# Altium schematic sheet Sheet1.SchDoc
size A4
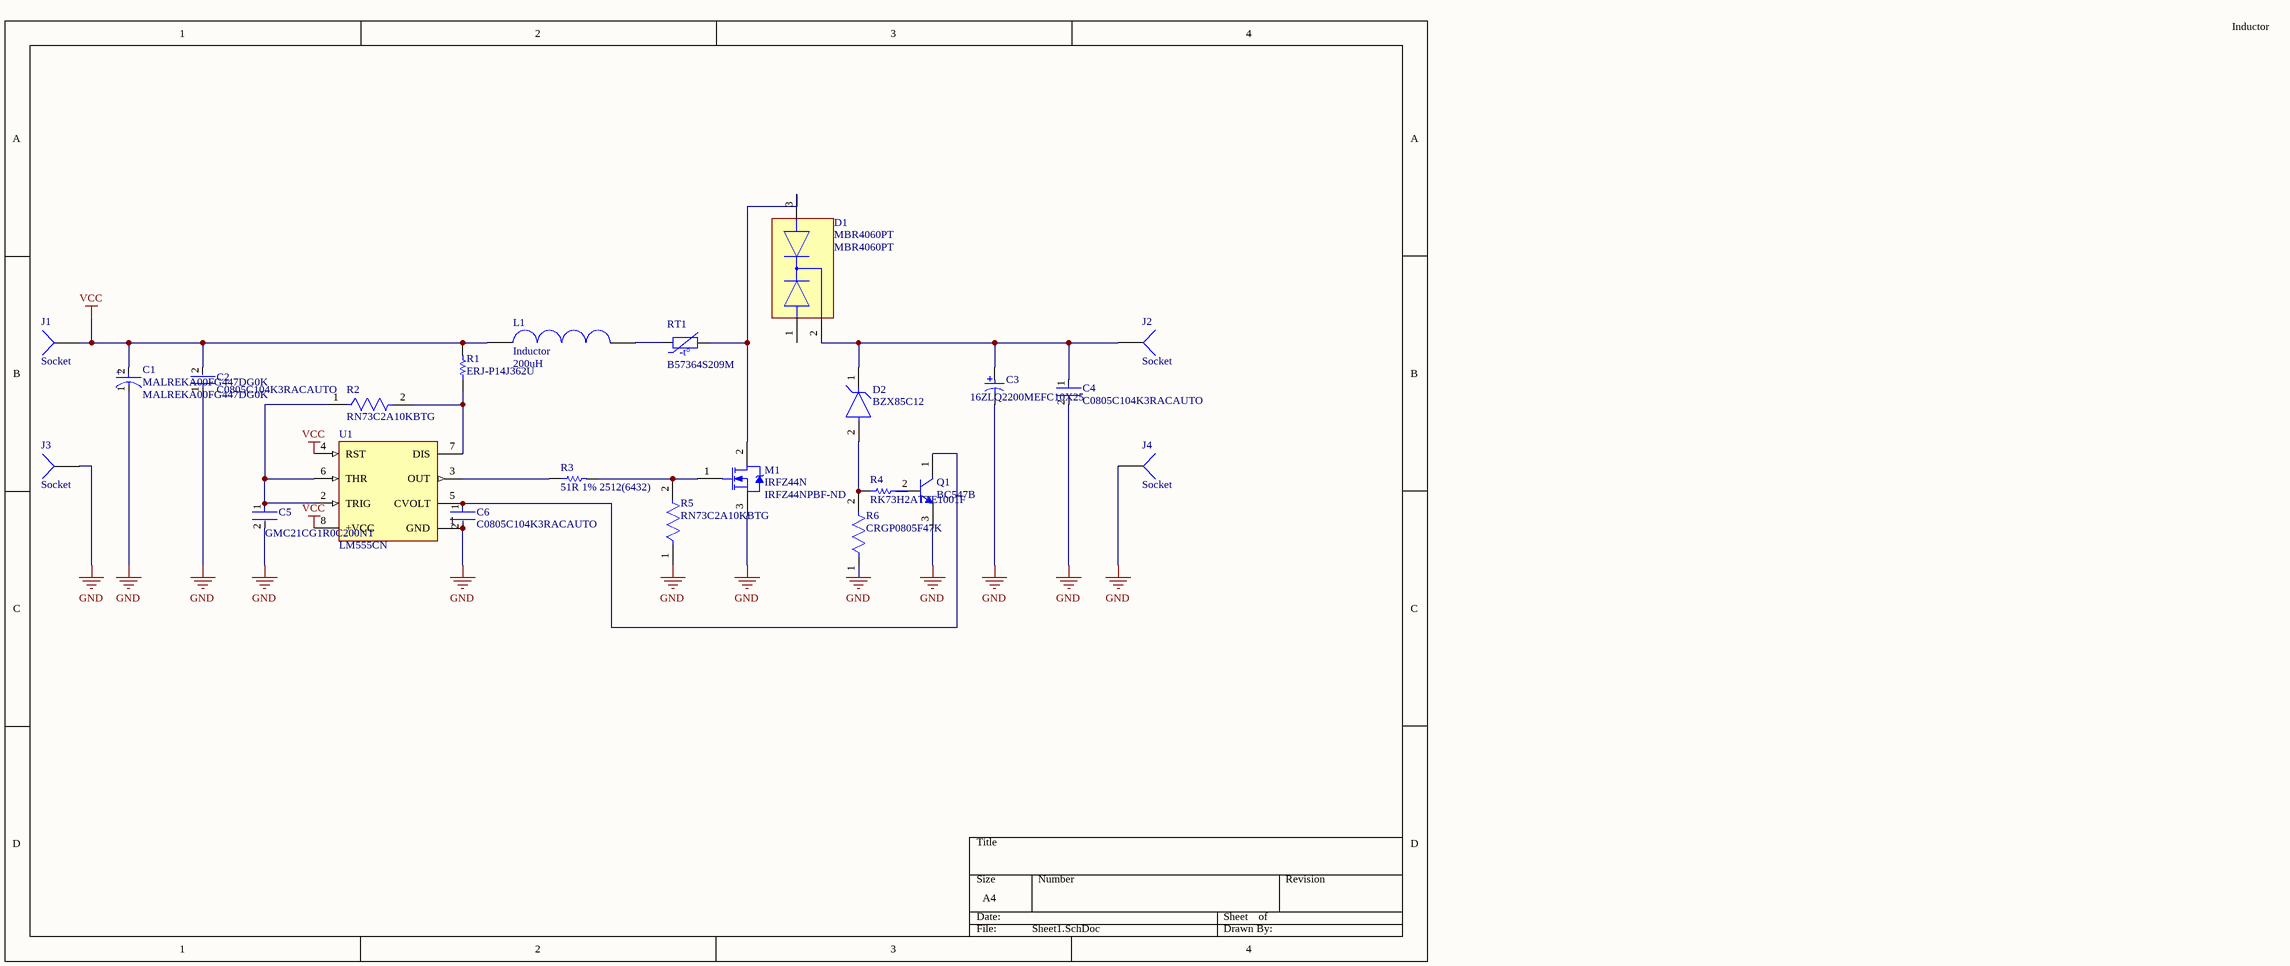
[diagram p0: Sheet1.SchDoc]

## Parts
C1  MALREKA00FG447DG0K  [FP-ECA-1HM102-MFG]
C2  C0805C104K3RACAUTO  [FP-C0805C-DN-IPC_A]
C3  16ZLQ2200MEFC10X25  [PNSC-EEUFM1H221-2]
C4  C0805C104K3RACAUTO  [FP-C0805C-DN-IPC_A]
C5  GMC21CG1R0C200NT  [FP-C0805C-DN-IPC_A]
C6  C0805C104K3RACAUTO  [FP-C0805C-DN-IPC_A]
D1  MBR4060PT  [FP-340BZ-MFG]
D2  BZX85C12  [FP-017AH-MFG]
J1  Socket  [PIN1]
J2  Socket  [PIN1]
J3  Socket  [PIN1]
J4  Socket  [PIN1]
L1  Inductor  value 200uH  [Inductor]
M1  IRFZ44N  Supplier Part Number 1: IRFZ44NPBF-ND  [INF-PG-TO220-3-1]
Q1  BC547B  [ONSC-TO-92-3-29-11]
R1  ERJ-P14J362U  [RESC3225X70X50ML20T20]
R2  RN73C2A10KBTG  [FP-RN732A-IPC_A]
R3  51R 1% 2512(6432)  [RESC2512(6432)_M]
R4  RK73H2ATTE1001F  [RESC2013X60X30ML20T20]
R5  RN73C2A10KBTG  [FP-RN732A-IPC_A]
R6  CRGP0805F47K  [FP-CRGP0805-IPC_A]
RT1  B57364S209M  [TDK-B57364]
U1  LM555CN  [N08E]

## Nets
GND: C1.1(C) C2.1 C3.2 C4.2 C5.2 C6.2 J3.1 J4.1 M1.3(SOURCE) Q1.3(E) R5.1 R6.1 U1.1(GND)
VCC: C1.2(A) C2.2 J1.1 L1.2 R1.2 U1.4(RST) U1.8(+VCC)
NetC3_1: C3.1 C4.1 D1.2(COMMON_CATHODE) D2.1(C) J2.1
NetC5_1: C5.1 R2.1 U1.2(TRIG) U1.6(THR)
NetC6_1: C6.1 Q1.1(C) U1.5(CVOLT)
NetD1_3: D1.3(2_ANODE) M1.2(DRAIN) RT1.1
NetD2_2: D2.2(A) R4.1 R6.2
NetL1_1: L1.1 RT1.2
NetM1_1: M1.1(GATE) R3.2 R5.2
NetQ1_2: Q1.2(B) R4.2
NetR1_1: R1.1 R2.2 U1.7(DIS)
NetR3_1: R3.1 U1.3(OUT)

Not connected (* = marked no-connect by the designer): D1 1(1_ANODE)

## Notes on the sheet
- Inductor
- (in symbol CMP-2000-05907-1) -t°
- (in symbol MALREKA00FG447DG0K) +

## Library data of the parts
C1 = MALREKA00FG447DG0K: Cap Alum 4700UF 20% 16V Radial; Manufacturer: Vishay Roederstein; Capacitance: 4.7mF; ESR (Equivalent Series Resistance): 80mR; Polarity: Polar; Ripple Current: 2.129A; Life (Hours): 2000Hour; Supplier 1: Avnet; Manufacturer Part Number: MALREKA00FG447DG0K; RoHS: Yes; Category: Aluminum Electrolytic Capacitors; Pricing 1: 2000=0,67103, 2800=0,65462, 4800=0,64540, 10000=0,62696, 20000=0,61313, 100000=0,59930, 200000=0,58547 (USD); Mount: Through Hole; Case/Package: Radial; Min Operating Temperature: -40°C; Max Operating Temperature: 85°C; Package Quantity: 400; Packaging: Bulk; Voltage Rating: 16V; Tolerance: 20%; Lead Pitch: 0.197inch; Height - Seated (Max): 1.063inch; RoHS Compliant: Yes; ComponentLink1URL: http://www.vishay.com/docs/25001/alucapsintroduction.pdf?src-supplier=Digi-Key; ComponentLink1Description: http://www.vishay.com/docs/25001/alucapsintroduction.pdf?src-supplier=Digi-Key; Supplier Part Number 1: MALREKA00FG447DG0K
C2 C4 C6 = CMP-2007-01164-2: CAP CER 0.1UF 25V X7R 0805; Manufacturer: KEMET; Temperature Coefficient: 30ppm/°C; Material: Ceramic; Capacitance: 0.10 μF; Value: 0.10 μF; Tolerance: 0.1; Ipc Land Pattern Name: CAPC200125X78; Height: 0.88mm; Device Class L3: Ceramic Capacitors; Temperature Characteristic: X7R; Temperature Range High: +125°C; Automotive: No; Category: Cap; Temperature Range Low: -55°C; Lead Free: Yes; Device Class L1: Passive Components; ComponentLink2Description: Datasheet; Manufacturer Part Number: C0805C104K3RACAUTO; Octopart: https://octopart.com/c0805c104k3racauto-kemet-12542886; Temperature: -55°C to +125°C; RoHS: TRUE; Package: C0805C-DN; Voltage Rating: 25 V; Device Class L2: Capacitors; Digikey Description: CAP CER 0.1UF 25V X7R 0805; Mouser Description: Smd Multilayer Ceramic Capacitor, Aec-Q200 C Series, 0.1 F, 10%, X7r, 25 V, 0805 [2012 Metric]; ComponentLink2URL: https://content.kemet.com/datasheets/KEM_C1003_C0G_SMD.pdf
C3 = 16ZLQ2200MEFC10X25: Cap Aluminum Lytic 2200uF 16V 20% (10 X 25mm) Radial 5mm 2500mA 5000h 105C; Manufacturer: Rubycon; Life (Hours): 5000Hour; Capacitance: 2.2mF; Polarity: Polar; Ripple Current: 1.75A; Impedance: 15mR; Supplier 1: Digi-Key; Manufacturer Part Number: 16ZLQ2200MEFC10X25; RoHS: Yes; Category: Aluminum Electrolytic Capacitors; Stock 1: 488; Pricing 1: 1=0,98000, 10=0,72100, 50=0,57700, 100=0,49460, 500=0,39156, 1000=0,32973, 2500=0,30912, 5000=0,28851 (USD); Mount: Through Hole; Case/Package: Radial; Min Operating Temperature: -40°C; Max Operating Temperature: 105°C; Tolerance: 20%; Packaging: Bulk; Voltage Rating: 16V; Lead Pitch: 0.197inch; Height - Seated (Max): 1.063inch; ComponentLink1URL: http://www.rubycon.co.jp/en/catalog/e_pdfs/aluminum/e_ZLQ.pdf?src-supplier=Digi-Key; ComponentLink1Description: http://www.rubycon.co.jp/en/catalog/e_pdfs/aluminum/e_ZLQ.pdf?src-supplier=Digi-Key
C5 = CMP-2007-00243-2: / 1 pF ±0.25pF 200V Ceramic Capacitor C0G, NP0 0805R 0805; Manufacturer: KEMET; Manufacturer Part Number: C0805C102K5RACAUTO; Temperature Coefficient: 30ppm/°C; Capacitance: 1pF; Temperature Characteristic: X7R; Value: 1 pF; Tolerance: 0.1; Temperature: -55°C to +125°C; Digikey Description: 1 pF ±0.25pF 200V Ceramic Capacitor C0G, NP0 0805 (2012 Metric); Temperature Range Low: -55°C; Package: C0805C-DN; Ipc Land Pattern Name: CAPC200125X78; ComponentLink2Description: Datasheet; Device Class L3: Ceramic Capacitors; Temperature Range High: +125°C; Category: Cap; Octopart: https://octopart.com/c0805c102k5racauto-kemet-12563740; RoHS: TRUE; ComponentLink2URL: https://content.kemet.com/datasheets/KEM_C1003_C0G_SMD.pdf; Device Class L2: Capacitors; Automotive: No; Mouser Description: Cap Ceramic 0.001uF 50V X7R 10% Pad SMD 0805 125C Automotive T/R; Height: 0.88mm; Device Class L1: Passive Components; Lead Free: Yes; Material: Ceramic; Voltage Rating: 200 V
D1 = MBR4060PT: Schottky Diodes & Rectifiers 43 amp Rectifiers Schottky Barrier; Manufacturer: ON Semiconductor / Fairchild; Element Configuration: Common Cathode; Max Repetitive Reverse Voltage (Vrrm): 60V; Forward Current: 40A; Max Reverse Current: 100mA; Peak Non-Repetitive Surge Current: 400A; Forward Voltage: 720mV; Max Reverse Leakage Current: 1mA; Supplier 1: Arrow Electronics; Manufacturer Part Number: MBR4060PT; RoHS: Yes; Category: Schottky Diodes; Stock 1: 226; Pricing 1: 1=2,70350, 10=1,95840, 100=1,82790, 250=1,49630, 500=1,48140, 1000=1,41390 (USD); Mount: Through Hole; Case/Package: TO-247; Number of Pins: 3; Weight: 5.508g; Min Operating Temperature: -65°C; Max Operating Temperature: 150°C; Packaging: Rail/Tube; Package Quantity: 30; Average Rectified Current: 40A; Max Reverse Voltage (DC): 60V; Max Forward Surge Current (Ifsm): 400A; Max Surge Current: 400A; Current Rating: 40A; Voltage Rating (DC): 60V; Length: 16.4mm; Width: 5.22mm; Height: 21.3mm; Radiation Hardening: No; RoHS Compliant: Yes; Lead Free: Lead Free; ComponentLink1URL: https://datasheet.ciiva.com/4714/mbr4060pt-195686-4714526.pdf?src-supplier=Mouser; ComponentLink1Description: https://datasheet.ciiva.com/4714/mbr4060pt-195686-4714526.pdf?src-supplier=Mouser; ComponentLink2URL: https://datasheet.ciiva.com/17322/mbr4060pt-17322588.pdf?src-supplier=Future+Electronics; ComponentLink2Description: https://datasheet.ciiva.com/17322/mbr4060pt-17322588.pdf?src-supplier=Future+Electronics; ComponentLink3URL: https://datasheet.ciiva.com/8300/mbr4060pt-8300748.pdf?src-supplier=Avnet; ComponentLink3Description: https://datasheet.ciiva.com/8300/mbr4060pt-8300748.pdf?src-supplier=Avnet; Supplier Part Number 1: MBR4060PT
D2 = CMP-07164-000008-1: DIODE ZENER 12V 1W DO41; Manufacturer: ON Semiconductor; Max Zener Voltage: 12.7V; Zener Impedance: 9Ω; Reverse Voltage: 8.4V; Forward Current: 200mA; Max Reverse Leakage Current: 0.5uA; Max Junction Temp: +200°C; Device Class L3: Zener Diodes; Device Class L2: Diodes; ComponentLink2URL: https://www.onsemi.com/pub/Collateral/BZX85C3V3-D.PDF; Mouser Description: Zener Diodes 12V 1W Zener; Automotive: No; Ipc Land Pattern Name: DIOPA1088W105L520D272; Digikey Description: DIODE ZENER 12V 1W DO41; Power Dissipation: 1W; Temperature Range High: +200°C; Height: 2.72mm; Package: 017AH; RoHS: TRUE; Category: Diode; Lead Free: Yes; Octopart: https://octopart.com/bzx85c12-on+semiconductor-84409056; Device Class L1: Discrete Semiconductors; Nom Zener Voltage: 12V; Manufacturer Part Number: BZX85C12; Temperature Range Low: -65°C; Footprint Url: https://www.onsemi.com/pub/Collateral/017AH.PDF; Temperature: -65°C to +200°C; ComponentLink2Description: Datasheet
M1 = IRFZ44N: MOSFET, Power; N-Ch; VDSS 55V; RDS(ON) 17.5 Milliohms; ID 49A; TO-220AB; PD 94W; -55deg; Manufacturer: International Rectifier; Rise Time: 185ns; Gate to Source Voltage (Vgs): 20V; Turn-On Delay Time: 19ns; Turn-Off Delay Time: 85ns; Fall Time: 165ns; Number of Elements: 1; Supplier 1: Digi-Key; Manufacturer Part Number: IRFZ44N; RoHS: No; Category: MOSFETs; Stock 1: 16256; Pricing 1: 1=1,25000, 10=1,12000, 25=1,06280, 100=0,87290, 500=0,72108, 1000=0,57752 (USD); Mount: Through Hole; Case/Package: TO-220AB; Number of Pins: 3; Min Operating Temperature: -55°C; Max Operating Temperature: 175°C; Continuous Drain Current (ID): 49A; Power Dissipation: 94W; ComponentLink1URL: http://components.arrow.com/part/dataview/0323_01885316?src-supplier=Arrow+Europe; ComponentLink1Description: http://components.arrow.com/part/dataview/0323_01885316?src-supplier=Arrow+Europe
Q1 = CMP-1048-01467-1: Amplifier Transistor, NPN Silicon, 3-Pin TO-92, Bulk Box; Manufacturer: On Semiconductor; IC Continuous (A): 0.1; fT Min (MHz): 150; DatasheetVersion: Rev. 7; ComponentLink1URL: http://www.onsemi.com/; Polarity: NPN; RoHS: FALSE; ComponentLink1Description: Manufacturer URL; Packing: Bulk Box; PackageDescription: 3-Pin Transistor Outline, Body 4.825 x 3.685 mm, Pitch 1.27 mm; ComponentLink3URL: http://www.onsemi.cn/pub_link/Collateral/2N6426-D.PDF; ComponentLink2Description: Datasheet; PackageVersion: Rev. AM; PackageReference: TO-92-3-29-11_AM_SL; ComponentLink3Description: Package Specification; Mounting Technology: Through Hole; PartNumber: BC547B; ComponentLink2URL: http://www.onsemi.com/pub_link/Collateral/BC546-D.PDF
R1 = CMP-2005-03719-1: Manufacturer: Panasonic; Part Number: ERJ-P14J362U
R2 R5 = CMP-03211-001029-1: SMD Chip Resistor, Thin Film, 10KΩ, 100 V, 0805 [2012 Metric], 100 mW, 0.1%, RN73 Series; Manufacturer: TE Connectivity; Temperature Coefficient: 10ppm/°C; Voltage Rating: 100V; Power Rating: 0.1W; Value: 10KΩ; Composition: Thin Film; Manufacturer Part Number: RN73C2A10KBTG; Package: RN732A; Device Class L2: Resistors; Device Class L1: Passive Components; ComponentLink2Description: Datasheet; Category: Res; Lead Free: Yes; Height: 0.65mm; packaging: 250 cut tape length; Temperature Range High: 155°C; Temperature: -55°C to 155°C; Tolerance: 0.1%; Octopart: https://octopart.com/rn73c2a10kbtg-te+connectivity-21411919; Temperature Range Low: -55°C; Device Class L3: Chip SMD Resistors; Resistance: 10KΩ; Series: RN73; RoHS: TRUE; ComponentLink2URL: https://www.te.com/commerce/DocumentDelivery/DDEController?Action=showdoc&DocId=Data+Sheet%7F1773270%7FP%7Fpdf%7FEnglish%7FENG_DS_1773270_P.pdf%7F1676162-2; Ipc Land Pattern Name: RESC200125X55; Automotive: No; octopart_url: https://octopart.com/rn73c2a10kbtg-te+connectivity-21411919
R3 = CMP-1018-00364-1: 51R 1W 1% 2512 (6432 Metric)  SMD; Case-Metric: 6432; Value: 51.00 Ohm; Case-EIA: 2512; Technology: SMT; Tolerance: 1 %; Power: 1 W
R4 = CMP-2001-01881-1: Manufacturer: KOA Speer; Part Number: RK73H2ATTE1001F
R6 = CMP-03211-006358-1: CRGP0805 47KΩ 0.33W ±100ppm/°C 1% 150V; Manufacturer: TE; Tolerance: 0.01; RoHS: TRUE; Voltage Rating: 150V; Device Class L1: Passive Components; ComponentLink2Description: Datasheet; Series: CRGP; Resistance: 47KΩ; Value: 47KΩ; Manufacturer Part Number: CRGP0805F47K; Automotive: No; Ipc Land Pattern Name: RESC200125X55; Temperature Coefficient: ±100ppm/°C; Lead Free: Yes; Package: CRGP0805; Temperature Range High: +155°C; Device Class L3: Chip SMD Resistors; Category: Res; Temperature: -55°C to +155°C; Composition: Thick Film; Ambient Temperature Range High: +70°C; Power Rating: 0.33W; Octopart: https://octopart.com/crgp0805f47k-te+connectivity-91018823; ComponentLink2URL: https://www.mouser.com/datasheet/2/418/NG_DS_9-1773463-9_A-1358566.pdf; Temperature Range Low: -55°C; Device Class L2: Resistors; Height: 0.65mm
RT1 = CMP-2000-05907-1: Inrush Current Limiter, 2 Ohm, -55 to 170 degC, 2-Pin THD, RoHS, Bulk; Manufacturer: TDK; Package Description: 2-Pin Through Hole Device, Body 21 x 7 mm; Package Reference: B57364; Manufacturer URL: http://www.tdk.com/; Datasheet URL: https://en.tdk.eu/inf/50/db/icl_16/S364.pdf; Mounting Technology: ThroughHole; Datasheet Version: 11/2015
U1 = CMP-0056-00017-2: Timer, 8-pin MDIP; Manufacturer: National Semiconductor; CompType: Analog IC; PackageTopMarking: NSUZXYTTE#*LM*555CN; PowerWise: N; PackageReference: N08E; ComponentLink1Description: LM555 Datasheet; ComponentLink3URL: http://www.national.com/packaging/folders/n08e.html; ComponentLink1URL: http://www.national.com/ds/LM/LM555.pdf; ComponentLink2URL: http://www.national.com/pf/LM/LM555.html; PackageDescription: MDIP, .365 x .250 x .130in, 8 Lead, .100in Pitch; DatasheetVersion: Jul-2006; RevisionNote: Component URLs added; Code_JEDEC: MS-001-BA; PinCount: 8; ComponentLink3Description: N08E Package Page; PackageVersion: revG, May-2006; ComponentLink2Description: LM555 Web Page; RoHS: N
J1-J4 = Socket: LatestRevisionDate: 17-Jul-2002; LatestRevisionNote: Re-released for DXP Platform.; Publisher: Altium Limited